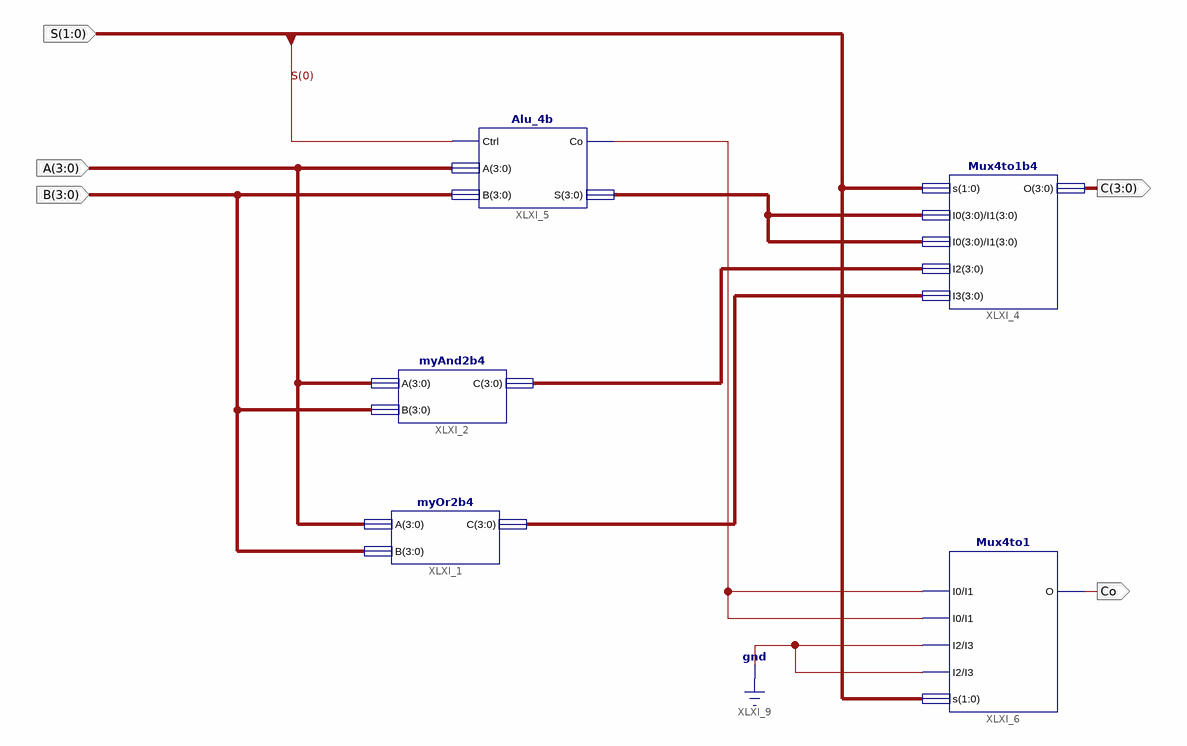
[diagram p0: schematic sheet 1]
// Xilinx ISE schematic myALU.sch (kintex7) as structural Verilog: 5 symbols, 5 ports
module myALU (
  input  [3:0] A,
  input  [3:0] B,
  input  [1:0] S,
  output [3:0] C,
  output Co
);

  wire XLXN_7;
  wire [3:0] XLXN_8, XLXN_9, XLXN_10;

  Mux4to1b4 XLXI_4 (.s(S), .I0(XLXN_10), .I1(XLXN_10), .I2(XLXN_8), .I3(XLXN_9), .O(C));
  Alu_4b XLXI_5 (.Ctrl(S[0]), .A(A), .B(B), .Co(XLXN_7), .S(XLXN_10));
  Mux4to1 XLXI_6 (.I0(XLXN_7), .I1(XLXN_7), .I2(1'b0), .I3(1'b0), .s(S), .O(Co));
  myOr2b4 XLXI_1 (.A(A), .B(B), .C(XLXN_9));
  myAnd2b4 XLXI_2 (.A(A), .B(B), .C(XLXN_8));
endmodule
